# Altium project Mini_proj.PrjPcb
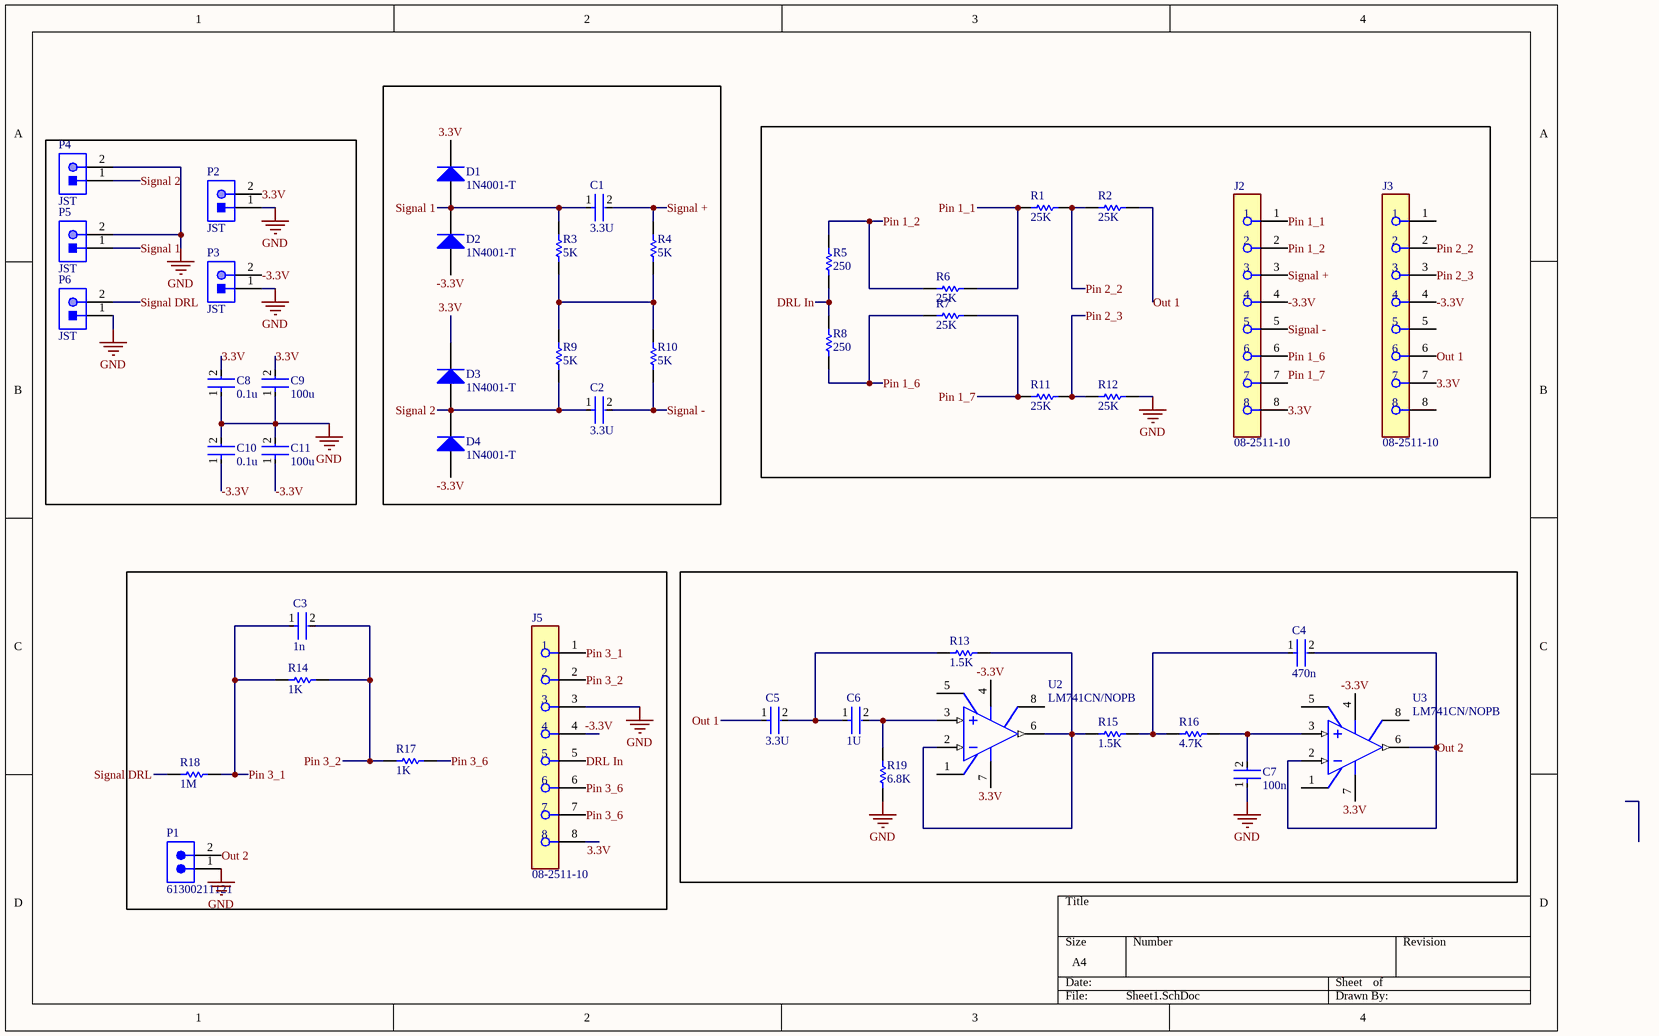
[diagram p0: Sheet1.SchDoc]
1 sheet, 45 parts. Net scope: global (net labels, ports and power ports of the same name join across sheets).
Board file: final.PcbDoc

## Sheet Sheet1.SchDoc
size A4; SheetNumber: 1; SheetTotal: 1

### Parts
C1  3.3U  [FP-RCE3DB-MFG]
C2  3.3U  [FP-RCE3DB-MFG]
C3  1n  [FP-RCE3DB-MFG]
C4  470n  [FP-RCE3DB-MFG]
C5  3.3U  [FP-RCE3DB-MFG]
C6  1U  [FP-RCE3DB-MFG]
C7  100n  [FP-RCE3DB-MFG]
C8  0.1u  [FP-RCE3DB-MFG]
C9  100u  [FP-RCE3DB-MFG]
C10  0.1u  [FP-RCE3DB-MFG]
C11  100u  [FP-RCE3DB-MFG]
D1  1N4001-T  [DIOD-DO-41-P-2_V]
D2  1N4001-T  [DIOD-DO-41-P-2_V]
D3  1N4001-T  [DIOD-DO-41-P-2_V]
D4  1N4001-T  [DIOD-DO-41-P-2_V]
J2  08-2511-10  [FP-08-2511-10-MFG]
J3  08-2511-10  [FP-08-2511-10-MFG]
J5  08-2511-10  [FP-08-2511-10-MFG]
P1  61300211121  [61300211121]
P2  JST  [JST-S2B-PH-K-S_V]
P3  JST  [JST-S2B-PH-K-S_V]
P4  JST  [JST-S2B-PH-K-S_V]
P5  JST  [JST-S2B-PH-K-S_V]
P6  JST  [JST-S2B-PH-K-S_V]
R1  25K  [RESA60-630X240]
R2  25K  [RESA60-630X240]
R3  5K  [RESA60-630X240]
R4  5K  [RESA60-630X240]
R5  250  [RESA60-630X240]
R6  25K  [RESA60-630X240]
R7  25K  [RESA60-630X240]
R8  250  [RESA60-630X240]
R9  5K  [RESA60-630X240]
R10  5K  [RESA60-630X240]
R11  25K  [RESA60-630X240]
R12  25K  [RESA60-630X240]
R13  1.5K  [RESA60-630X240]
R14  1K  [RESA60-630X240]
R15  1.5K  [RESA60-630X240]
R16  4.7K  [RESA60-630X240]
R17  1K  [RESA60-630X240]
R18  1M  [RESA60-630X240]
R19  6.8K  [RESA60-630X240]
U2  LM741CN/NOPB  [P0008A]
U3  LM741CN/NOPB  [P0008A]

### Nets
GND: C7.1 C8.1 C9.1 C10.2 C11.2 J5.3 P1.1 P2.1 P3.1 P4.2 P5.2 P6.1 R12.1 R19.2
3.3V: C8.2 C9.2 D1.2(K) D3.2(K) J2.8 J3.7 J5.8 P2.2 U2.7(V+) U3.7(V+)
-3.3V: C10.1 C11.1 D2.1(A) D4.1(A) J2.4 J3.4 J5.4 P3.2 U2.4(V-) U3.4(V-)
DRL In: J5.5 R5.2 R8.1
Out 1: C5.1 J3.6 R2.1
Out 2: C4.2 P1.2 U3.2(IN-) U3.6(OUT)
Pin 1_1: J2.1 R1.2 R6.1
Pin 1_2: J2.2 R5.1 R6.2
Pin 1_6: J2.6 R7.2 R8.2
Pin 1_7: J2.7 R7.1 R11.2
Pin 2_2: J3.2 R1.1 R2.2
Pin 2_3: J3.3 R11.1 R12.2
Pin 3_1: C3.1 J5.1 R14.2 R18.1
Pin 3_2: C3.2 J5.2 R14.1 R17.2
Pin 3_6: J5.6 J5.7 R17.1
Signal 1: C1.1 D1.1(A) D2.2(K) P5.1 R3.2
Signal 2: C2.1 D3.1(A) D4.2(K) P4.1 R9.1
Signal +: C1.2 J2.3 R4.2
Signal -: C2.2 J2.5 R10.1
Signal DRL: P6.2 R18.2
NetC4_1: C4.1 R15.1 R16.2
NetC5_2: C5.2 C6.1 R13.2
NetC6_2: C6.2 R19.1 U2.3(IN+)
NetC7_2: C7.2 R16.1 U3.3(IN+)
NetR3_1: R3.1 R4.1 R9.2 R10.2
NetR13_1: R13.1 R15.2 U2.2(IN-) U2.6(OUT)

Not connected (* = marked no-connect by the designer): J3 1 5 8; U2 1(OFS_NULL) 5(OFS_NULL) 8(NC); U3 1(OFS_NULL) 5(OFS_NULL) 8(NC)

### Library data of the parts
C1-C11 = CMP-06035-005830-1: Cap Ceramic 10uF 25V X7R ±10% Radial 2.5mm +125°C Automotive Ammo Pack; Lead/Base Style: Straight; Lead Diameter: 0.5mm; Case/Package: Radial; Voltage Rating (DC): 25V; Tolerance: 10%; Lead Pitch: 0.098inch; Termination: Radial; Height - Seated (Max): 0.197inch; Resistor Type: Ceramic; Min Operating Temperature: -55°C; Dielectric: X7R; Length: 0.217inch; Voltage Rating: 25V; Width: 0.157inch; Height: 5mm; Packaging: Tape and Reel; Ratings: AEC-Q200; Max Operating Temperature: 125°C; Package Quantity: 1500; Mount: Through Hole; Capacitance: 10uF
D1-D4 = CMP-0639-00006-2: 1.0 A Rectifier, 15 pF, 50 V, -65 to 150 degC, 2-Pin DO-41 Plastic, RoHS, Tape and Reel; Manufacturer: Diodes Inc; VF (V): 1; CT (pF): 15; Max. IR (uA): 5; VRRM (V): 50; Max. IFSM (A): 30; RoHS: TRUE; Mounting Technology: Through Hole; PartNumber: 1N4001-T; ComponentLink2Description: Datasheet; DatasheetVersion: Rev. 8-2; Operating Temperature Range (degC): -65 to 150; Packing: Tape and Reel; PackageReference: DO-41-P-2; ComponentLink1URL: http://diodes.com/; PackageDescription: 2-Pin Axial Lead, Body 4.635 x 2.36 mm, Lead Spread 25.4 mm; ComponentLink2URL: http://diodes.com/datasheets/ds28002.pdf; Max. Average Rectified Current IO (A): 1; ComponentLink1Description: Manufacturer URL
J2 J3 J5 = CMP-40957-000003-1: CONN IC DIP SOCKET 8POS TIN; Manufacturer: Aries Electronics; Pitch: 2.54mm; Conn Gender: Female; Is Female: yes; Number Of Contacts: 8; Current Rating: 1A; Standoff Height: 0.51mm; Conn Orientation: Vertical; Socket Package: DIP8; Device Class L2: IC and Component Sockets; Lead Free: Yes; Package: 0; Automotive: No; ComponentLink2URL: https://www.arieselec.com/products/data/12004-dip-test-socket.pdf; Contact Material: Tin; Height: 7.75mm; Digikey Description: CONN IC DIP SOCKET 8POS TIN; Temperature Range High: +105°C; RoHS: TRUE; ComponentLink2Description: Datasheet; Temperature: -55°C to +105°C; Temperature Range Low: -55°C; Device Class L1: Connectors; Device Class L3: unset; Manufacturer Part Number: 08-2511-10; Octopart: https://octopart.com/08-2511-10-aries-767661; Number Of Rows: 2; Category: Conn
P1 = CMP-1712-00002-6: NexarPartId: 20081794; Number of Contacts: 2; Pitch: 2.54mm; Connector Type: Male Pin; Voltage Rating: 250V; Current Rating: 3A; Gender: Male; Contact Resistance: 20mΩ; Height: 8.94mm; Lead Free: Lead Free; Number of Pins: 2; Termination: Through Hole; RoHS: Compliant; Lead Pitch: 2.54mm; REACH SVHC: No SVHC; Housing Material: PBT; Contact Mating Length: 5.9944mm; Min Operating Temperature: -40°C; Orientation: Vertical; Contact Material: Copper; Contact Gender: Male; Max Operating Temperature: 125°C; Number of Rows: 1; Number of Positions: 2; Packaging: Bulk; Contact Plating: Gold; Mount: Through Hole; Color: Black; Operating Supply Voltage: 250V
P2-P6 = CMP-1755-00004-1: Male Header, Pitch 2 mm, 1 x 2 Position, Height 4.8 mm, Tail Length 3.4 mm, -25 to 85 degC, RoHS, Bulk; Case\Package: Radial; Tolerance: 20%; Capacitance: 10 uF; Voltage Rating (DC): 50 V; Packaging: Bulk; ComponentLink1URL: http://www.jst-mfg.com/product/pdf/eng/ePH.pdf; Radiation Hardening: No; Height: 11 mm; Package Quantity: 200; PackageDescription: Male Header, Pitch 2 mm, 1 x 2 Position, Height 4.8 mm, Tail Length 3.4 mm; PackageReference: S2B-PH-K-S; Diameter: 5 mm; Pins: 2; Mount: Through Hole; Max Operating Temperature: 85 degC; Min Operating Temperature: -40 degC; ComponentLink1Description: Datasheet; DatasheetVersion: Dec-12; Length: 11 mm; Lead Pitch: 2 mm; REACH SVHC: No SVHC; Voltage Rating: 50 V; RoHSCompliant: true
R1-R19 = CMP-1659-00075-1: Axial Resistor, 1 KOhm, +/- 1%, 250 mW, -55 to 155 degC, 2-Pin THD, RoHS, Bulk; Voltage Rating: 250 V; Resistance: 10 kohm; Power Rating: 250 mW; ComponentLink2Description: Datasheet; RoHSCompliant: true; PackageReference: MFR-25; Case\Package: Axial; Max Operating Temperature: 155 degC; DatasheetVersion: Apr-13; Tolerance: 1%; ComponentLink1URL: http://www.yageo.com/; Length: 0.248 inch; ComponentLink2URL: http://www.yageo.com/documents/recent/Yageo%20LR_MFR_2013.pdf; Packaging: Bulk; Package Quantity: 200; PackageDescription: 2-Pin Axial Lead, Dia 2.4 mm, Body Length 6.3 mm; Min Operating Temperature: -55 degC; ComponentLink1Description: Manufacturer URL
U2 U3 = CMP-0055-00162-3: Operational Amplifier, 8-pin MDIP, Pb-Free; Manufacturer: Texas Instruments; PackageTopMarking: NSUZXYTTE#*LM*741CN; PowerWise: N; CompType: Amplifiers; ComponentLink1Description: Datasheet URL; ComponentLink1URL: http://www.ti.com/general/docs/lit/getliterature.tsp?genericPartNumber=LM741&fileType=pdf; PackageDescription: MDIP, .365 x .250 x .130in, 8 Lead, .100in Pitch; RoHS: Y; PinCount: 8; Code_JEDEC: MS-001-BA; Package Reference: P0008A